# EAGLE design Hall_Touch (EAGLE 9.6.2)
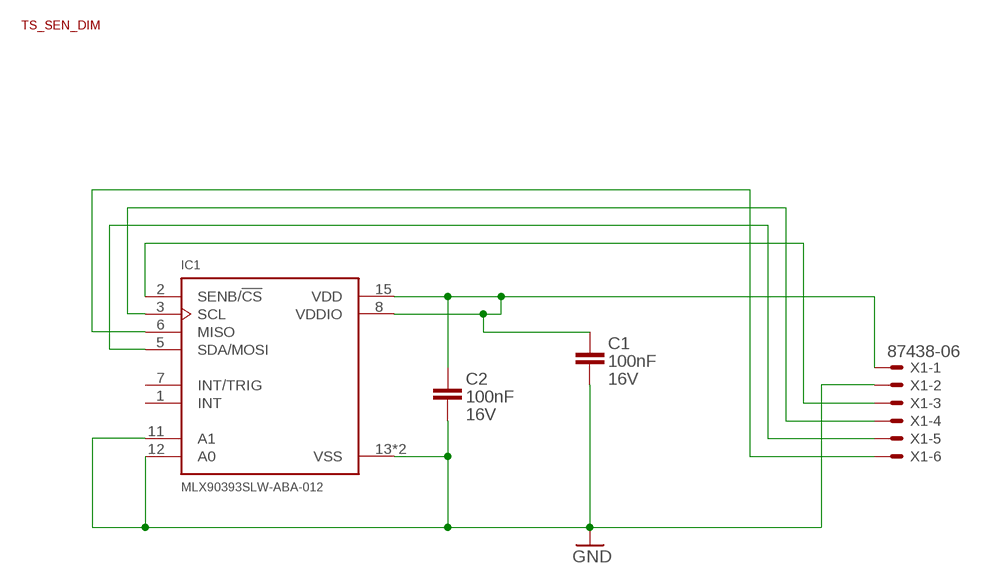
[diagram p0: schematic, sheet 1]

## Parts
C1  GCM155R71C104JA55  [C0402]
C2  GCM155R71C104JA55  [C0402]
DIMENSION1  TS_SEN_DIM  [SEN_DIM]
IC1  MLX90393SLW-ABA-012  [QFN50P300X300X100-17T180N]
X1  87438-06  [87438-06]

## Nets
GND: C1.2 C2.2 IC1.11(A1) IC1.12(A0) IC1.13(VSS) IC1.17(VSS) X1.2
N$2: IC1.2(SENB/!CS) X1.3
N$4: C1.1 C2.1 IC1.8(VDDIO) IC1.15(VDD) X1.1
N$5: IC1.5(SDA/MOSI) X1.5
N$6: IC1.6(MISO) X1.6
N$7: IC1.3(SCL) X1.4
Unconnected: IC1.1(INT) IC1.7(INT/TRIG)

## Library data of the parts
C1 C2 = msrm:GCM?R7*: Multilayer Ceramic Capacitors Chip Multilayer Ceramic Capacitors for Automotive –55 to 125°C Sources: Catalogue <https://www.murata.com/~/media/webrenewal/support/library/catalog/products/capacitor/mlcc/c03e.ashx?la=en-us> Part Numbering <https://search.murata.co.jp/Ceramy/image/img/A01X/partnumbering_e_02.pdf>; CAPACITANCE: 100nF; DIGIKEY: 490-16433-1-ND; TOLERANCE: ±5%; VOLTAGE: 16V
DIMENSION1 = msrm:TS_SEN_DIM: DImetion drawing for Sonja's sensors
IC1 = msrm:MLX90393?-
X1 = con-molex:87438-06: Wire-to-Board 1.50mm (.059") Pitch Header - Right Angle, SMT, Shrouded Source: http://www.molex.com/product/micro/87438.html; MF: MOLEX; MPN: 87438-0643; OC_FARNELL: 1756938; OC_NEWARK: 88K3155

## Board
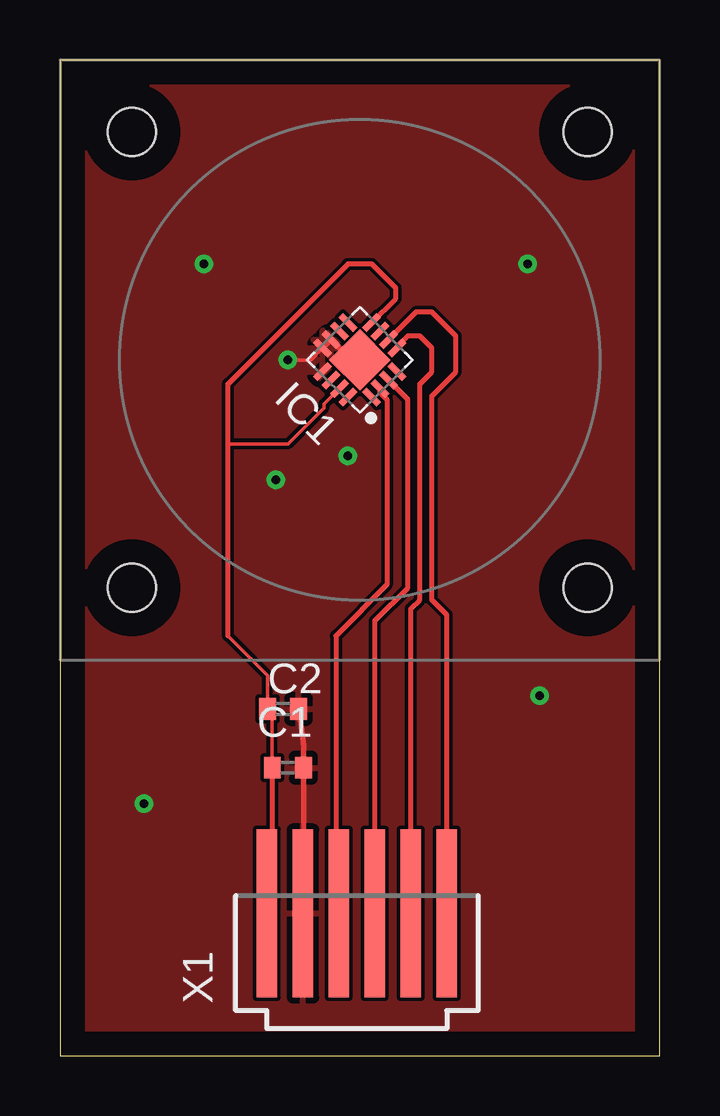
[diagram p1: board, top side]
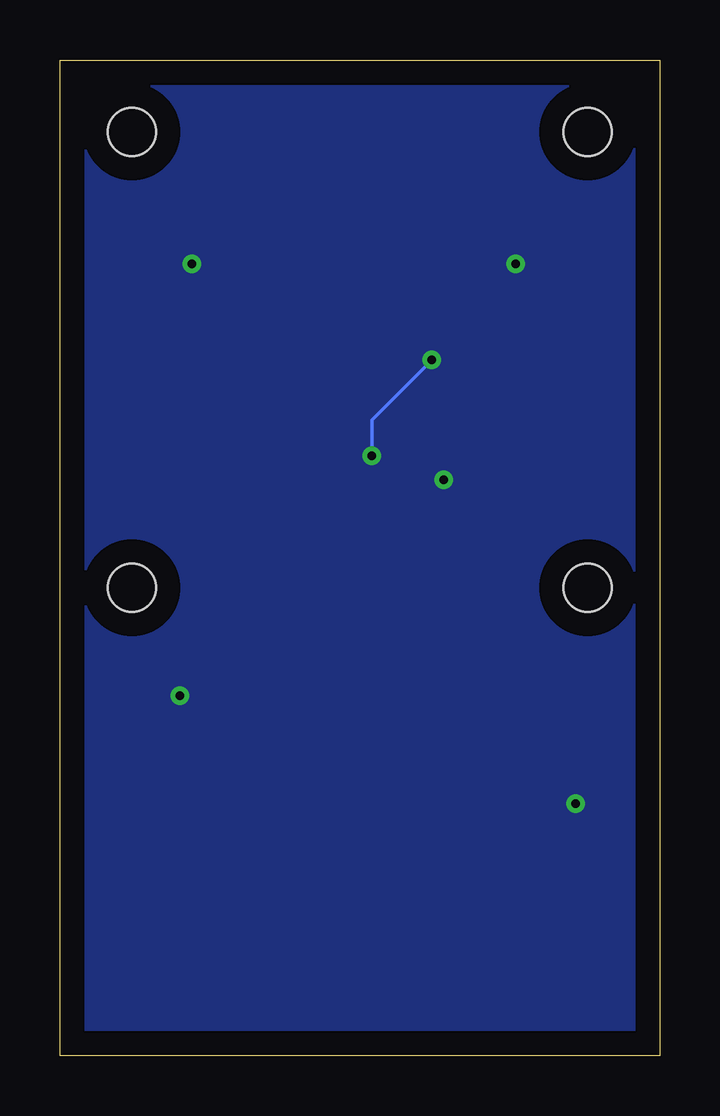
[diagram p2: board, bottom side, seen from below]

Size 25 x 41.5 mm. Coordinates in mm from the lower left corner, seen from the top.
Outline: 0,0 25,0 25,41.5 0,41.5 0,0
Copper layers (1*16): Top 0.035mm / dielectric 1.5mm / Bottom 0.035mm
Design rules "default": minimum track width 6mil, minimum drill 0.35mm, track to track 6mil, track to pad 6mil, pad to pad 6mil, via to via 6mil, smd to smd 6mil, copper to edge 40mil, drill to drill 6mil, minimum pad ring 10mil, minimum via ring 8mil, stop-mask expansion 4mil, vias tented up to drill 0mil, thermal gap 10mil

### Footprints (pad centres in the part's own frame; a part is rotated, then mirrored left to right if it is on the bottom)
C0402 = smd 0.7 x 0.9: 1 -0.65,0; 2 0.65,0
SEN_DIM = hole 2: -9.5,9.5; 9.5,9.5; 9.5,-9.5; -9.5,-9.5
QFN50P300X300X100-17T180N = smd 0.86 x 0.264: 1 -1.435,0.75; 2 -1.435,0.25; 3 -1.435,-0.25; 4 -1.435,-0.75; 9 1.435,-0.75; 10 1.435,-0.25; 11 1.435,0.25; 12 1.435,0.75 | smd 0.264 x 0.86: 5 -0.75,-1.435; 6 -0.25,-1.435; 7 0.25,-1.435; 8 0.75,-1.435; 13 0.75,1.435; 14 0.25,1.435; 15 -0.25,1.435; 16 -0.75,1.435 | smd 1.8 x 1.8: 17 0,0
87438-06 = smd 7 x 0.85: 1 0,3.75; 2 0,2.25; 3 0,0.75; 4 0,-0.75; 5 0,-2.25; 6 0,-3.75

### Placement (x,y rotation side)
C1  9.5,12 0 top
C2  9.3,14.45 0 top
DIMENSION1  12.5,29 90 top
IC1  12.5,29 135 top
X1  12.38,5.92 90 top

### Tracks (layer width: path | path; a pad name or v marks a point on that pad's centre or on a via)
GND  (via drill 0.35)
  Top 0.152: IC1.12 10.47,29 v9.5,29
  Top 0.2: X1.2 10.15,5.94 C1.2 10.15,12.95 C2.2 | 10.94,29.5 IC1.12 IC1.11 12.15,29 IC1.17
  Bottom 0.152: v9.5,29 12,26.5 v12,25
  other vias: 9,24 6,33 19.5,33 20,15 3.5,10.5
  pour Top: 0,41.5 25,41.5 25,0 0,0
  pour Bottom: 0,41.5 25,41.5 25,0 0,0
N$2
  Top 0.2: IC1.2 13.34,27.65 13.63,27.35 13.63,19.63 11.5,17.5 11.5,6.05 X1.3
N$4
  Top 0.152: IC1.15 11,27.15 11,27 9.5,25.5 7,25.5 | C1.1 8.85,14.25 C2.1 8.65,15.85 7,17.5
  Top 0.2: C1.1 8.85,8.85 8.5,8.5 8.5,6.05 X1.1 | IC1.8 14,31.56 14,32 13,33 12,33 7,28 7,25.5 7,17.5
N$5
  Top 0.2: X1.5 14.63,18.63 15,19 15,28 15.5,28.5 15.5,29.5 15,30 14.5,30 14.04,29.55 IC1.5
N$6
  Top 0.2: X1.6 16.13,18.37 15.5,19 15.5,27.5 16.5,28.5 16.5,30 15.5,31 14.85,31 IC1.6
N$7
  Top 0.2: X1.4 13.13,18.13 14.5,19.5 14.5,27.35 IC1.3